# Altium schematic sheet supply.SchDoc
size A3; Hw_rev: R1; Address3: Firenze; Address4: ITALY; Revision: 0; SheetNumber: 3; SheetTotal: 4
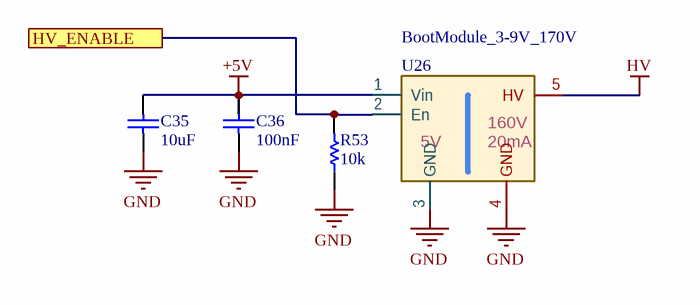
[diagram p0: supply.SchDoc]

## Parts
C35  10uF  [0603_[1608]]
C36  100nF  [0603_[1608]]
R53  10k  [0603_[1608]]
U26  BootModule_3-9V_170V  [BoostModule]

## Ports
HV_ENABLE

## Nets
+5V: C35.2 C36.2 U26.1(Vin)
GND: C35.1 C36.1 R53.1 U26.3(GND) U26.4(GND)
HV: U26.5(HV)
HV_ENABLE: R53.2 U26.2(En) ; port HV_ENABLE

## Notes on the sheet
- Title:
- Project:
- Desc:
- Variant:
- File:
- License:
- asterix24@gmail.com
- Ing. Daniele Basile
- Rev:
- Prj Rev:
- Status:
- Size:
- Date:
- Time:
- Sheet
- of
- A3
- (in symbol BootModule_3-9V_170V) 160V; 5V; 20mA

## Library data of the parts
C35 C36 = Cap: Capacitor; NOTE Manufacturer PN: *; NOTE Manufacturer: *; MountTechnology: *; CODE Develer: *; ComponentLink1Description: New link; ComponentLink1URL: *; NOTE Description: *; NOTE Description 2: *
  C35: Value: 10uF
  C36: Value: 100nF
R53 = Res: Resistor; Publisher: Develer srl; Revision: 0.1; NOTE Manufacturer PN: *; NOTE Manufacturer: *; MountTechnology: SMT; CODE Develer: *; NOTE Description: *; NOTE Description 2: *
U26 = BootModule_3-9V_170V: som boot power supply 3-9V to 170V; Publisher: Develer srl; Revision: 0.1; NOTE Manufacturer PN: *; NOTE Manufacturer: *; MountTechnology: SMT; CODE Develer: *; NOTE Description: *; NOTE Description 2: *